# Altium schematic sheet 201944AEP4P01.SchDoc
size A4
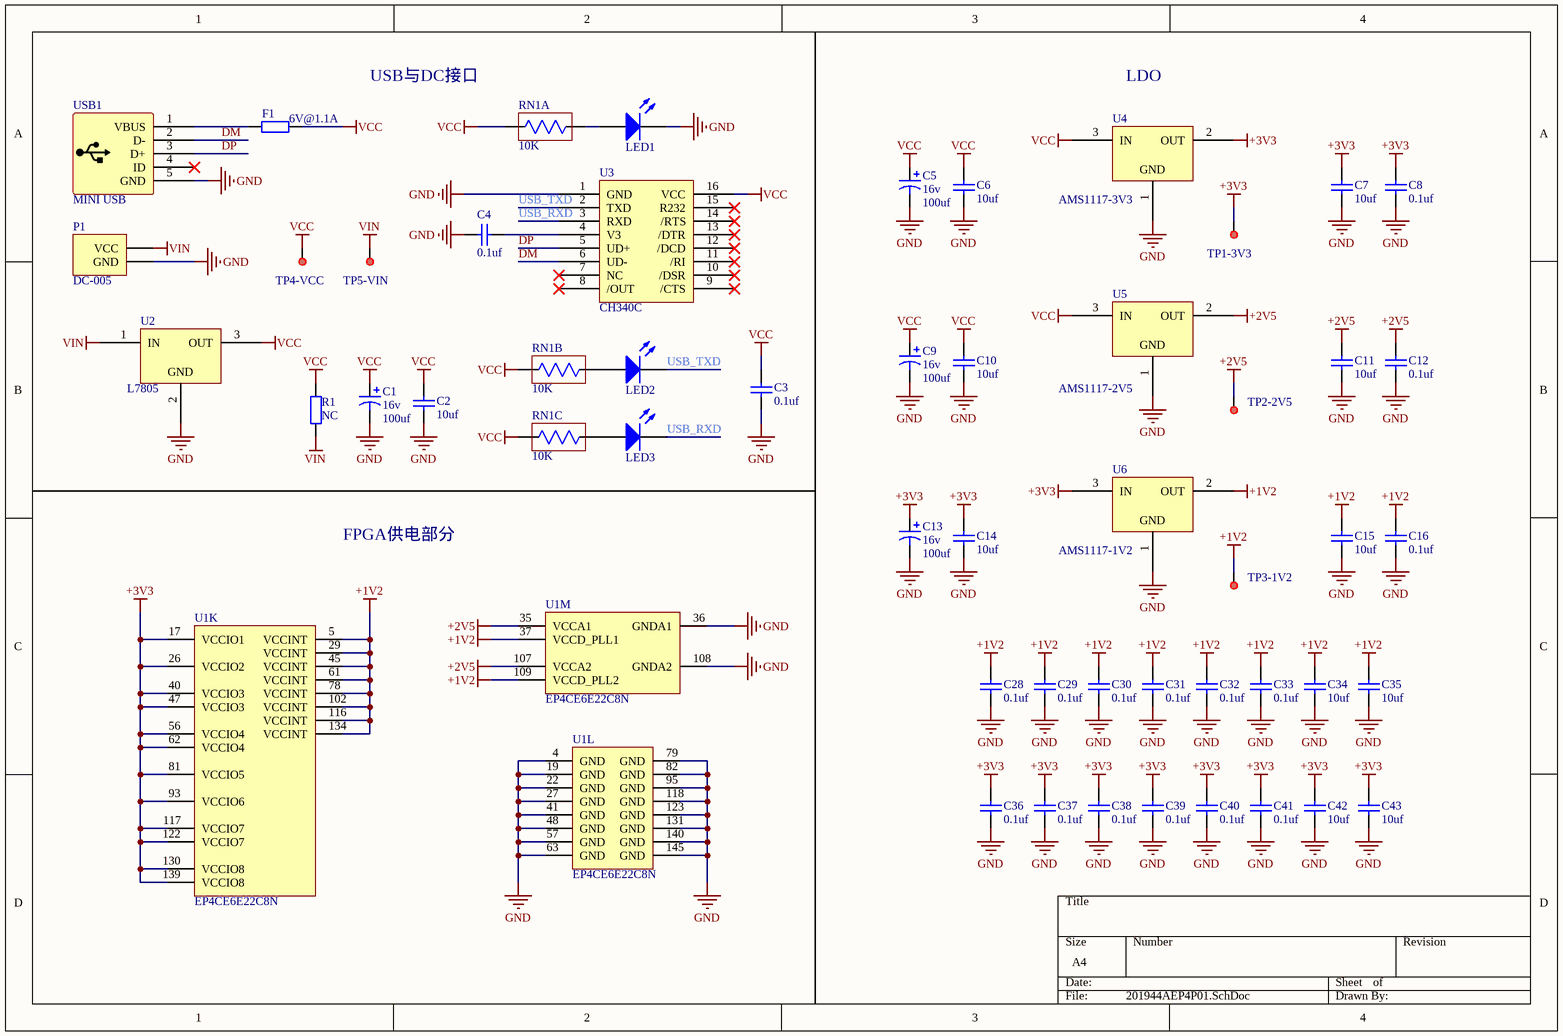
[diagram p0: 201944AEP4P01.SchDoc]

## Parts
C1  value 100uf  voltage: 16v  [C5X11]  (hidden comment: Cap2)
C2  value 10uf  [C1206]  (hidden comment: Cap)
C3  value 0.1uf  [C0805]  (hidden comment: Cap)
C4  value 0.1uf  [C0805]  (hidden comment: Cap)
C5  value 100uf  voltage: 16v  [C5X11]  (hidden comment: Cap2)
C6  value 10uf  [C1206]  (hidden comment: Cap)
C7  value 10uf  [C0805]  (hidden comment: Cap)
C8  value 0.1uf  [C0805]  (hidden comment: Cap)
C9  value 100uf  voltage: 16v  [C5X11]  (hidden comment: Cap2)
C10  value 10uf  [C1206]  (hidden comment: Cap)
C11  value 10uf  [C0805]  (hidden comment: Cap)
C12  value 0.1uf  [C0805]  (hidden comment: Cap)
C13  value 100uf  voltage: 16v  [C5X11]  (hidden comment: Cap2)
C14  value 10uf  [C1206]  (hidden comment: Cap)
C15  value 10uf  [C0805]  (hidden comment: Cap)
C16  value 0.1uf  [C0805]  (hidden comment: Cap)
C28  value 0.1uf  [C0805]  (hidden comment: Cap)
C29  value 0.1uf  [C0805]  (hidden comment: Cap)
C30  value 0.1uf  [C0805]  (hidden comment: Cap)
C31  value 0.1uf  [C0805]  (hidden comment: Cap)
C32  value 0.1uf  [C0805]  (hidden comment: Cap)
C33  value 0.1uf  [C0805]  (hidden comment: Cap)
C34  value 10uf  [C0805]  (hidden comment: Cap)
C35  value 10uf  [C0805]  (hidden comment: Cap)
C36  value 0.1uf  [C0805]  (hidden comment: Cap)
C37  value 0.1uf  [C0805]  (hidden comment: Cap)
C38  value 0.1uf  [C0805]  (hidden comment: Cap)
C39  value 0.1uf  [C0805]  (hidden comment: Cap)
C40  value 0.1uf  [C0805]  (hidden comment: Cap)
C41  value 0.1uf  [C0805]  (hidden comment: Cap)
C42  value 10uf  [C0805]  (hidden comment: Cap)
C43  value 10uf  [C0805]  (hidden comment: Cap)
F1  value 6V@1.1A  [R1206]  (hidden comment: Res)
LED1  LED  [LED1206]  (value not drawn)
LED2  LED  [LED1206]  (value not drawn)
LED3  LED  [LED1206]  (value not drawn)
P1  DC-005  [DC-005]
R1  value NC  [R0805]  (hidden comment: Res)
RN1  value 10K  [RA0603]  (hidden comment: Res Array)  (parts A,B,C of 4)
TP1-3V3  TestPoint  [TestPoint-R20]  (value not drawn)
TP2-2V5  TestPoint  [TestPoint-R20]  (value not drawn)
TP3-1V2  TestPoint  [TestPoint-R20]  (value not drawn)
TP4-VCC  TestPoint  [TestPoint-R20]  (value not drawn)
TP5-VIN  TestPoint  [TestPoint-R20]  (value not drawn)
U1  EP4CE6E22C8N  [EP4CE6E22C8N-EQFP144+]  (parts K,L,M of 13)
U2  L7805  [L7805-TO252]
U3  CH340C  [CH340C-SOP16]
U4  AMS1117-3V3  [AMS1117-SOT223]
U5  AMS1117-2V5  [AMS1117-SOT223]
U6  AMS1117-1V2  [AMS1117-SOT223]
USB1  MINI USB  [USB-Mini-SMT]

## Nets
+1V2: C15.2 C16.2 C28.2 C29.2 C30.2 C31.2 C32.2 C33.2 C34.2 C35.2 TP3-1V2.1 U1.5(VCCINT) U1.29(VCCINT) U1.37(VCCD_PLL1) U1.45(VCCINT) U1.61(VCCINT) U1.78(VCCINT) U1.102(VCCINT) U1.109(VCCD_PLL2) U1.116(VCCINT) U1.134(VCCINT) U6.2(OUT)
+2V5: C11.2 C12.2 TP2-2V5.1 U1.35(VCCA1) U1.107(VCCA2) U5.2(OUT)
+3V3: C7.2 C8.2 C13.1 C14.2 C36.2 C37.2 C38.2 C39.2 C40.2 C41.2 C42.2 C43.2 TP1-3V3.1 U1.17(VCCIO1) U1.26(VCCIO2) U1.40(VCCIO3) U1.47(VCCIO3) U1.56(VCCIO4) U1.62(VCCIO4) U1.81(VCCIO5) U1.93(VCCIO6) U1.117(VCCIO7) U1.122(VCCIO7) U1.130(VCCIO8) U1.139(VCCIO8) U4.2(OUT) U6.3(IN)
GND: C1.2 C2.1 C3.2 C4.2 C5.2 C6.1 C7.1 C8.1 C9.2 C10.1 C11.1 C12.1 C13.2 C14.1 C15.1 C16.1 C28.1 C29.1 C30.1 C31.1 C32.1 C33.1 C34.1 C35.1 C36.1 C37.1 C38.1 C39.1 C40.1 C41.1 C42.1 C43.1 LED1.2(K) P1.2(GND) U1.4(GND) U1.19(GND) U1.22(GND) U1.27(GND) U1.36(GNDA1) U1.41(GND) U1.48(GND) U1.57(GND) U1.63(GND) U1.79(GND) U1.82(GND) U1.95(GND) U1.108(GNDA2) U1.118(GND) U1.123(GND) U1.131(GND) U1.140(GND) U1.145(GND) U2.2(GND) U3.1(GND) U4.1(GND) U5.1(GND) U6.1(GND) USB1.5(GND)
VCC: C1.1 C2.2 C3.1 C5.1 C6.2 C9.1 C10.2 F1.2 R1.2 RN1.1 RN1.2 RN1.3 TP4-VCC.1 U2.3(OUT) U3.16(VCC) U4.3(IN) U5.3(IN)
VIN: P1.1(VCC) R1.1 TP5-VIN.1 U2.1(IN)
DM: U3.6(UD-) USB1.2(D-)
DP: U3.5(UD+) USB1.3(D+)
USB_RXD: LED3.2(K) U3.3(RXD)
USB_TXD: LED2.2(K) U3.2(TXD)
NetC4_1: C4.1 U3.4(V3)
NetF1_1: F1.1 USB1.1(VBUS)
NetLED1_1: LED1.1(A) RN1.8
NetLED2_1: LED2.1(A) RN1.7
NetLED3_1: LED3.1(A) RN1.6

Not connected (* = marked no-connect by the designer): U3 7(NC)* 8(/OUT)* 9(/CTS)* 10(/DSR)* 11(/RI)* 12(/DCD)* 13(/DTR)* 14(/RTS)* 15(R232)*; USB1 4(ID)*

## Notes on the sheet
- USB与DC接口
- LDO
- FPGA供电部分

## Library data of the parts
RN1 = Res Array 2: 贴片排阻
TP1-3V3 TP2-2V5 TP3-1V2 TP4-VCC TP5-VIN = TestPoint: 测试点
U1 = EP4CE6E22C8N: Cyclone IV Family FPGA, 1.2V Core, 91 I/O Pins, 2 PLLs, 144-Pin QFP, Speed Grade 8, Commercial Grade, Pb-Free; Manufacturer: Altera; DatasheetVersion: ver1.6, Nov-2011; PackageVersion: ver1.0, Jan-2011; PackageReference: EQFP144_A-165_D2-54; PackageDescription: 144-Pin Plastic Enhanced Quad Flat Pack (EQFP) - Wire Bond - A:1.65 - D2:5.4; Code_JEDEC: MS-026-BFB-HD; ComponentLink1Description: Manufacturer URL; ComponentLink1URL: http://www.altera.com/; ComponentLink2Description: Handbook; ComponentLink2URL: http://www.altera.com/literature/hb/cyclone-iv/cyclone4-handbook.pdf; ComponentLink3Description: Pinout; ComponentLink3URL: http://www.altera.com/literature/lit-dp.jsp?category=cyc%204&showspreadsheet=y; ComponentLink4Description: Package Specification; ComponentLink4URL: http://www.altera.com/devicepackaging/04R00402-00.pdf
U3 = CH340C: USB 转串口芯片
U4-U6 = AMS1117
USB1 = USB